# EAGLE design connect4 (EAGLE 9.6.1)
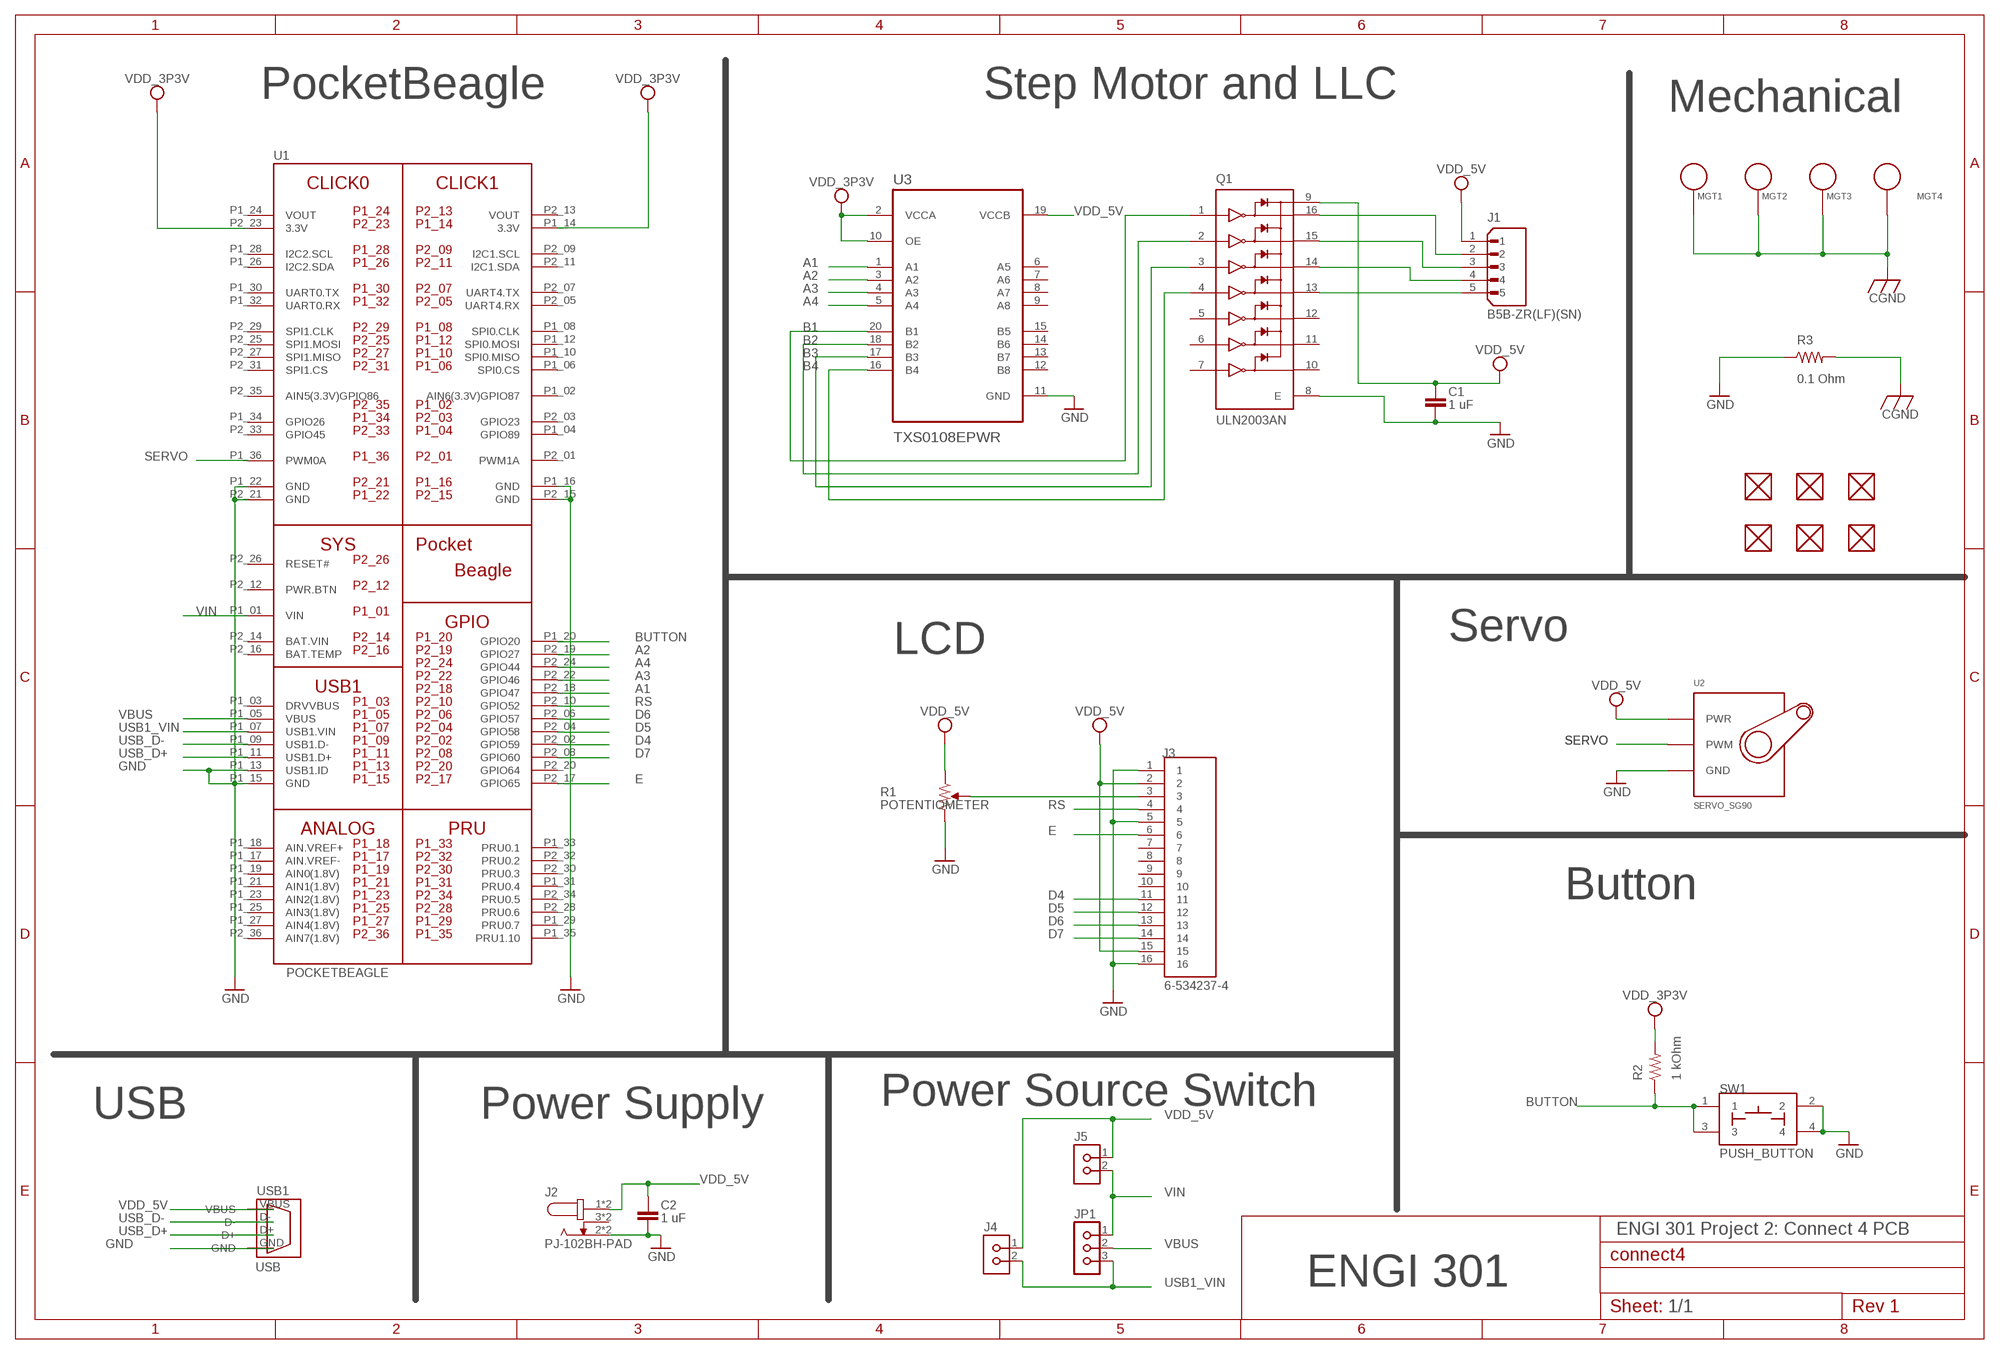
[diagram p0: schematic, sheet 1]

## Parts
C1  1 uF  C_C0402  [C0402]
C2  1 uF  C_C0402  [C0402]
FUD1  FIDUCIAL  [FIDUCIAL_40MIL]
FUD2  FIDUCIAL  [FIDUCIAL_40MIL]
FUD3  FIDUCIAL  [FIDUCIAL_40MIL]
FUD4  FIDUCIAL  [FIDUCIAL_40MIL]
FUD5  FIDUCIAL  [FIDUCIAL_40MIL]
FUD6  FIDUCIAL  [FIDUCIAL_40MIL]
J1  B5B-ZR(LF)(SN)  [JST_B5B-ZR(LF)(SN)]
J2  PJ-102BH-PAD  [CUI_PJ-102BH-DIM-SMT-PAD]
J3  6-534237-4  [TE_6-534237-4]
J4  PINHD-1X2  [H1X2-2.54]
J5  PINHD-1X2  [H1X2-2.54]
JP1  PINHD-1X3  [H1X3-2.54]
MGT1  MOUNTING_HOLE  [MOUNTING_HOLE]
MGT2  MOUNTING_HOLE  [MOUNTING_HOLE]
MGT3  MOUNTING_HOLE  [MOUNTING_HOLE]
MGT4  MOUNTING_HOLE  [MOUNTING_HOLE]
Q1  ULN2003AN  [DIP794W45P254L1969H508Q16]
R1  POTENTIOMETER  [POT-PO90S]
R2  1 kOhm  R_R0603  [R0603]
R3  0.1 Ohm  R_R0805  [R0805]
SW1  PUSH_BUTTON  [BUTTON_12.5MM]
U1  POCKETBEAGLE  [POCKETBEAGLE]
U2  SERVO_SG90  [SERVO-X1]
U3  TXS0108EPWR  [SOP65P640X120-20N]
USB1  USB  [USB]

## Nets
A1: U1.P2_18(GPIO47) U3.1(A1)
A2: U1.P2_19(GPIO27) U3.3(A2)
A3: U1.P2_22(GPIO46) U3.4(A3)
A4: U1.P2_24(GPIO44) U3.5(A4)
B1: Q1.1(1B) U3.20(B1)
B2: Q1.2(2B) U3.18(B2)
B3: Q1.3(3B) U3.17(B3)
B4: Q1.4(4B) U3.16(B4)
BUTTON: R2.1 SW1.1 SW1.3 U1.P1_20(GPIO20)
CGND: MGT1.P$1 MGT2.P$1 MGT3.P$1 MGT4.P$1 R3.2
D4: J3.11 U1.P2_02(GPIO59)
D5: J3.12 U1.P2_04(GPIO58)
D6: J3.13 U1.P2_06(GPIO57)
D7: J3.14 U1.P2_08(GPIO60)
E: J3.6 U1.P2_17(GPIO65)
GND: C1.2 C2.2 J2.2 J2.2_B J3.1 J3.5 J3.16 Q1.8(E) R1.CW R3.1 SW1.2 SW1.4 U1.P1_13(USB1.ID) U1.P1_15(GND) U1.P1_16(GND) U1.P1_22(GND) U1.P2_15(GND) U1.P2_21(GND) U2.GND U3.11(GND) USB1.GND
N$1: J1.2 Q1.16(1C)
N$2: J1.3 Q1.15(2C)
N$3: J3.3 R1.S
N$4: J1.4 Q1.14(3C)
N$5: J1.5 Q1.13(4C)
RS: J3.4 U1.P2_10(GPIO52)
SERVO: U1.P1_36(PWM0A) U2.SIG(PWM)
USB1_VIN: J4.2 JP1.3 U1.P1_07(USB1.VIN)
USB_D+: U1.P1_11(USB1.D+) USB1.D+
USB_D-: U1.P1_09(USB1.D-) USB1.D-
VBUS: JP1.2 U1.P1_05(VBUS)
VDD_3P3V: R2.2 U1.P1_14(3.3V) U1.P2_23(3.3V) U3.2(VCCA) U3.10(OE)
VDD_5V: C1.1 C2.1 J1.1 J2.1 J2.1_B J3.2 J3.15 J4.1 J5.1 Q1.9(COM) R1.CCW U2.PWR U3.19(VCCB) USB1.VBUS
VIN: J5.2 JP1.1 U1.P1_01(VIN)
Unconnected: FUD1.P$1 FUD2.P$1 FUD3.P$1 FUD4.P$1 FUD5.P$1 FUD6.P$1 J2.3 J2.3_B J3.7 J3.8 J3.9 J3.10 Q1.5(5B) Q1.6(6B) Q1.7(7B) Q1.10(7C) Q1.11(6C) Q1.12(5C) U1.P1_02(AIN6(3.3V)GPIO87) U1.P1_03(DRVVBUS) U1.P1_04(GPIO89) U1.P1_06(SPI0.CS) U1.P1_08(SPI0.CLK) U1.P1_10(SPI0.MISO) U1.P1_12(SPI0.MOSI) U1.P1_17(AIN.VREF-) U1.P1_18(AIN.VREF+) U1.P1_19(AIN0(1.8V)) U1.P1_21(AIN1(1.8V)) U1.P1_23(AIN2(1.8V)) U1.P1_25(AIN3(1.8V)) U1.P1_26(I2C2.SDA) U1.P1_27(AIN4(1.8V)) U1.P1_28(I2C2.SCL) U1.P1_29(PRU0.7) U1.P1_30(UART0.TX) U1.P1_31(PRU0.4) U1.P1_32(UART0.RX) U1.P1_33(PRU0.1) U1.P1_34(GPIO26) U1.P1_35(PRU1.10) U1.P2_01(PWM1A) U1.P2_03(GPIO23) U1.P2_05(UART4.RX) U1.P2_07(UART4.TX) U1.P2_09(I2C1.SCL) U1.P2_11(I2C1.SDA) U1.P2_12(PWR.BTN) U1.P2_16(BAT.TEMP) U1.P2_20(GPIO64) U1.P2_25(SPI1.MOSI) U1.P2_26(RESET#) U1.P2_27(SPI1.MISO) U1.P2_28(PRU0.6) U1.P2_29(SPI1.CLK) U1.P2_30(PRU0.3) U1.P2_31(SPI1.CS) U1.P2_32(PRU0.2) U1.P2_33(GPIO45) U1.P2_34(PRU0.5) U1.P2_35(AIN5(3.3V)GPIO86) U1.P2_36(AIN7(1.8V)) U3.6(A5) U3.7(A6) U3.8(A7) U3.9(A8) U3.12(B8) U3.13(B7) U3.14(B6) U3.15(B5)

## Notes on the sheet
- PocketBeagle | Step Motor and LLC | Mechanical
- LCD | Servo
- Button
- USB | Power Supply | Power Source Switch
- ENGI 301 Project 2: Connect 4 PCB
- ENGI 301
- 1/1

## Power pins joined to a net without a drawn wire
BAT.VIN: U1.P2_14(BAT.VIN)
VOUT: U1.P1_24(VOUT) U1.P2_13(VOUT)

## Library data of the parts
C1 C2 = MISC:C_: Capacitor SMD. Sizes: 0402, 0603 & 0805
FUD1-FUD6 = connect4:FIDUCIAL
J1 = connect4:B5B-ZR(LF)(SN): Check availability <https://pricing.snapeda.com/parts/B5B-ZR%20%28LF%29%28SN%29/JST/view-part?ref=eda>; AVAILABILITY: In Stock; DESCRIPTION: Conn Shrouded Header HDR 5 POS 1.5mm Solder ST Thru-Hole Box; MF: JST; MP: B5B-ZR (LF)(SN); PACKAGE: None; PRICE: None; PURCHASE-URL: https://pricing.snapeda.com/search/part/B5B-ZR (LF)(SN)/?ref=eda
J2 = connect4:PJ-102BH: 2.5 mm Center Pin, 5.0 A, Right Angle, Through Hole, Tapered Pins, Dc Power Jack Connector; MANUFACTURER: CUI INC; PART_REV: 1.02; STANDARD: Manufacturer recommendations
J3 = connect4:6-534237-4: Check availability <https://pricing.snapeda.com/parts/6-534237-4/TE%20Connectivity/view-part?ref=eda>; AVAILABILITY: In Stock; COMMENT: 6-534237-4; DESCRIPTION: 16 MODII VRT SR CE 100/115; EU_ROHS_COMPLIANCE: Compliant; MF: TE Connectivity; MP: 6-534237-4; PACKAGE: None; PRICE: None; PURCHASE-URL: https://pricing.snapeda.com/search/part/6-534237-4/?ref=eda
J4 J5 = connect4:PINHD-1X2: 2-pin 100 mil header
JP1 = connect4:PINHD-1X3: PIN HEADER
MGT1-MGT4 = connect4:MOUNTING_HOLE: Chassis Mounting Hole w/GND connection ability
Q1 = connect4:ULN2003AN: Check availability <https://pricing.snapeda.com/parts/ULN2003AN/Texas%20Instruments/view-part?ref=eda>; AVAILABILITY: In Stock; DESCRIPTION: 50-V, 7-ch darlington transistor array, -20C to 70C; MF: Texas Instruments; MP: ULN2003AN; PACKAGE: PDIP-16 Texas Instruments; PRICE: None; PURCHASE-URL: https://pricing.snapeda.com/search/part/ULN2003AN/?ref=eda
R1 = connect4:POTENTIOMETER: Potentiometer - Examples: P090S-14T20BR10K (987-1277-ND)
R2 R3 = connect4:R_: RESISTOR, American symbol
SW1 = connect4:PUSH_BUTTON
U1 = connect4:POCKETBEAGLE
U2 = connect4:SERVO_SG90
U3 = connect4:TXS0108EPWR: Check availability <https://pricing.snapeda.com/parts/TXS0108EPWR/Texas%20Instruments/view-part?ref=eda>; AVAILABILITY: In Stock; DESCRIPTION: 8-bit bidirectional voltage-level shifter for open-drain and push-pull application; MF: Texas Instruments; MP: TXS0108EPWR; PACKAGE: TSSOP-20 Texas Instruments; PRICE: None; PURCHASE-URL: https://pricing.snapeda.com/search/part/TXS0108EPWR/?ref=eda
USB1 = connect4:USB: USB-A1HSW6 USB-A (USB TYPE-A) - Receptacle Connector 4 Position Through Hole, Right Angle

## Board
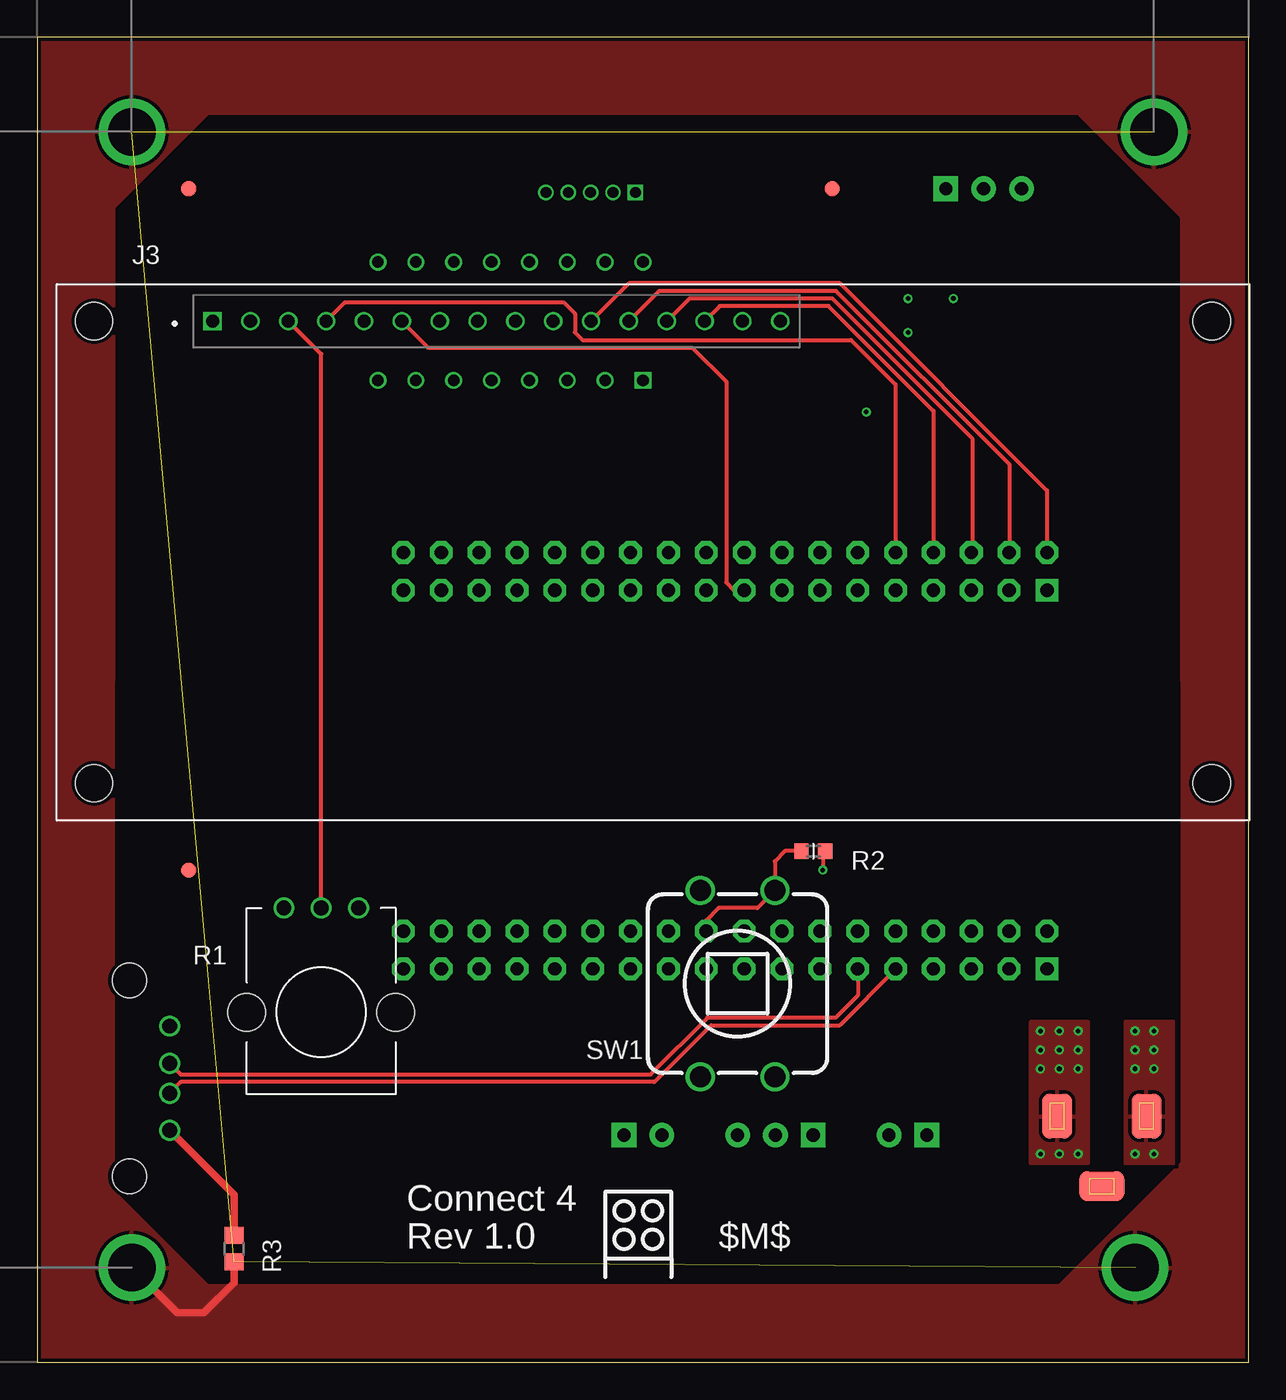
[diagram p1: board, top side]
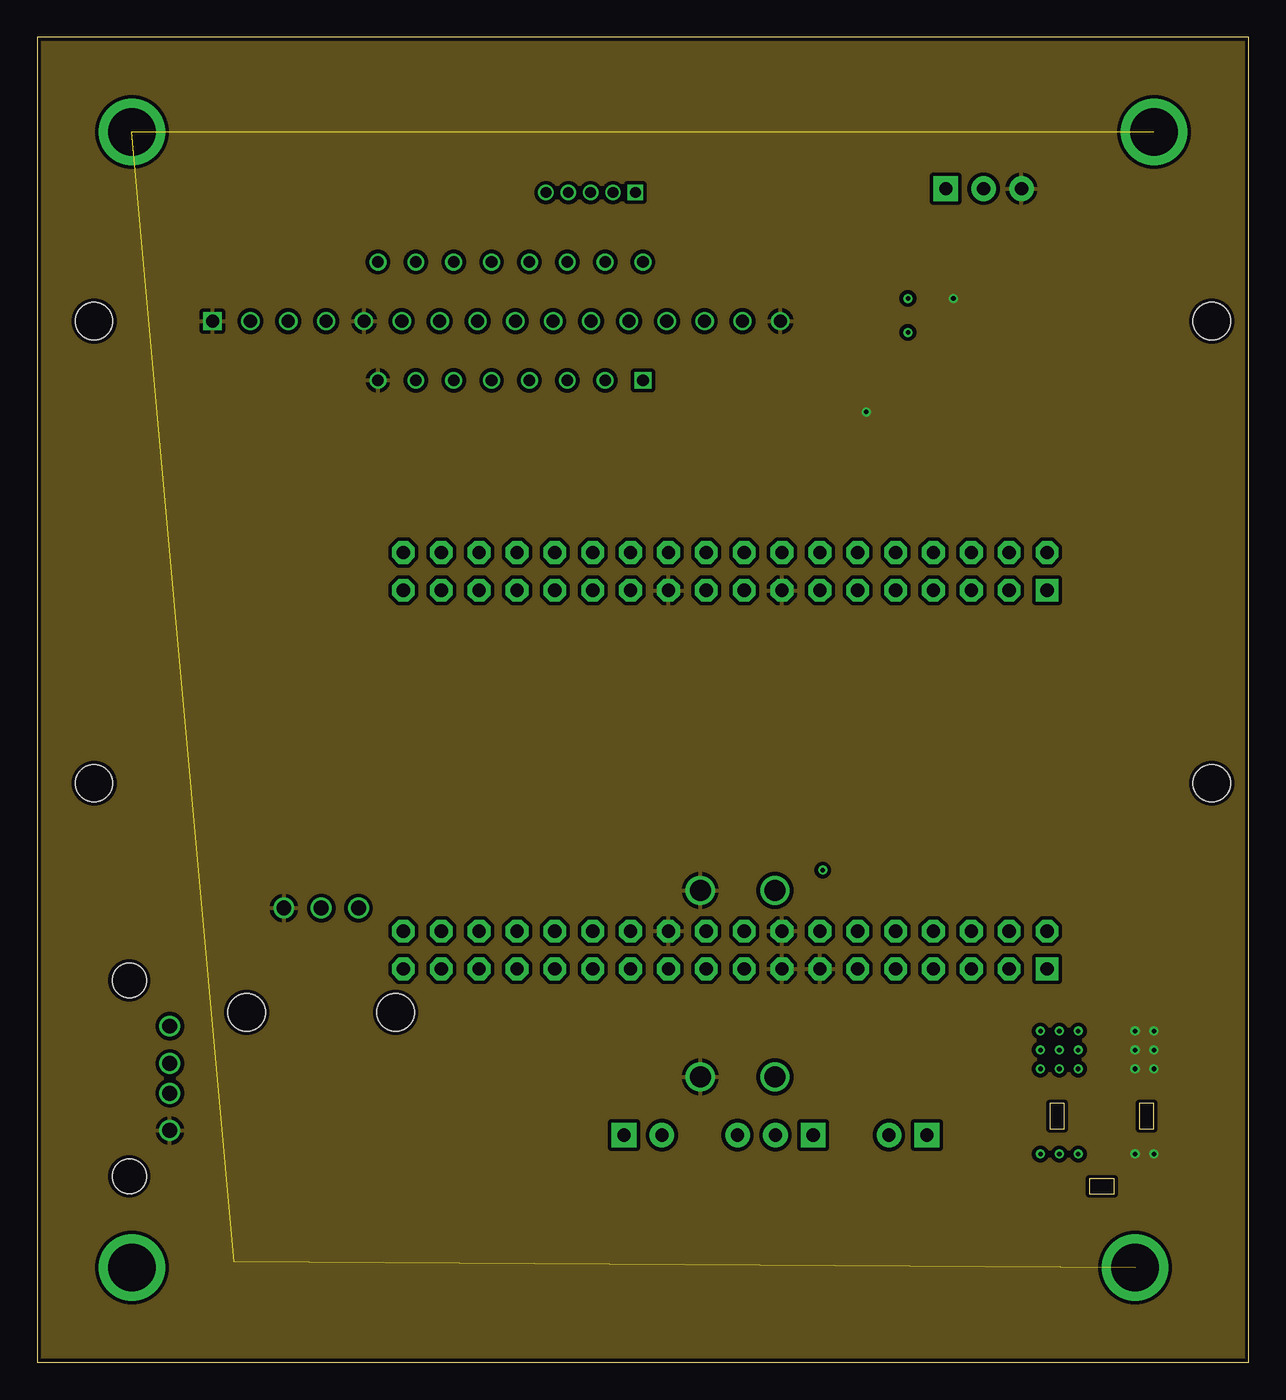
[diagram p2: board, inner layer Route2]
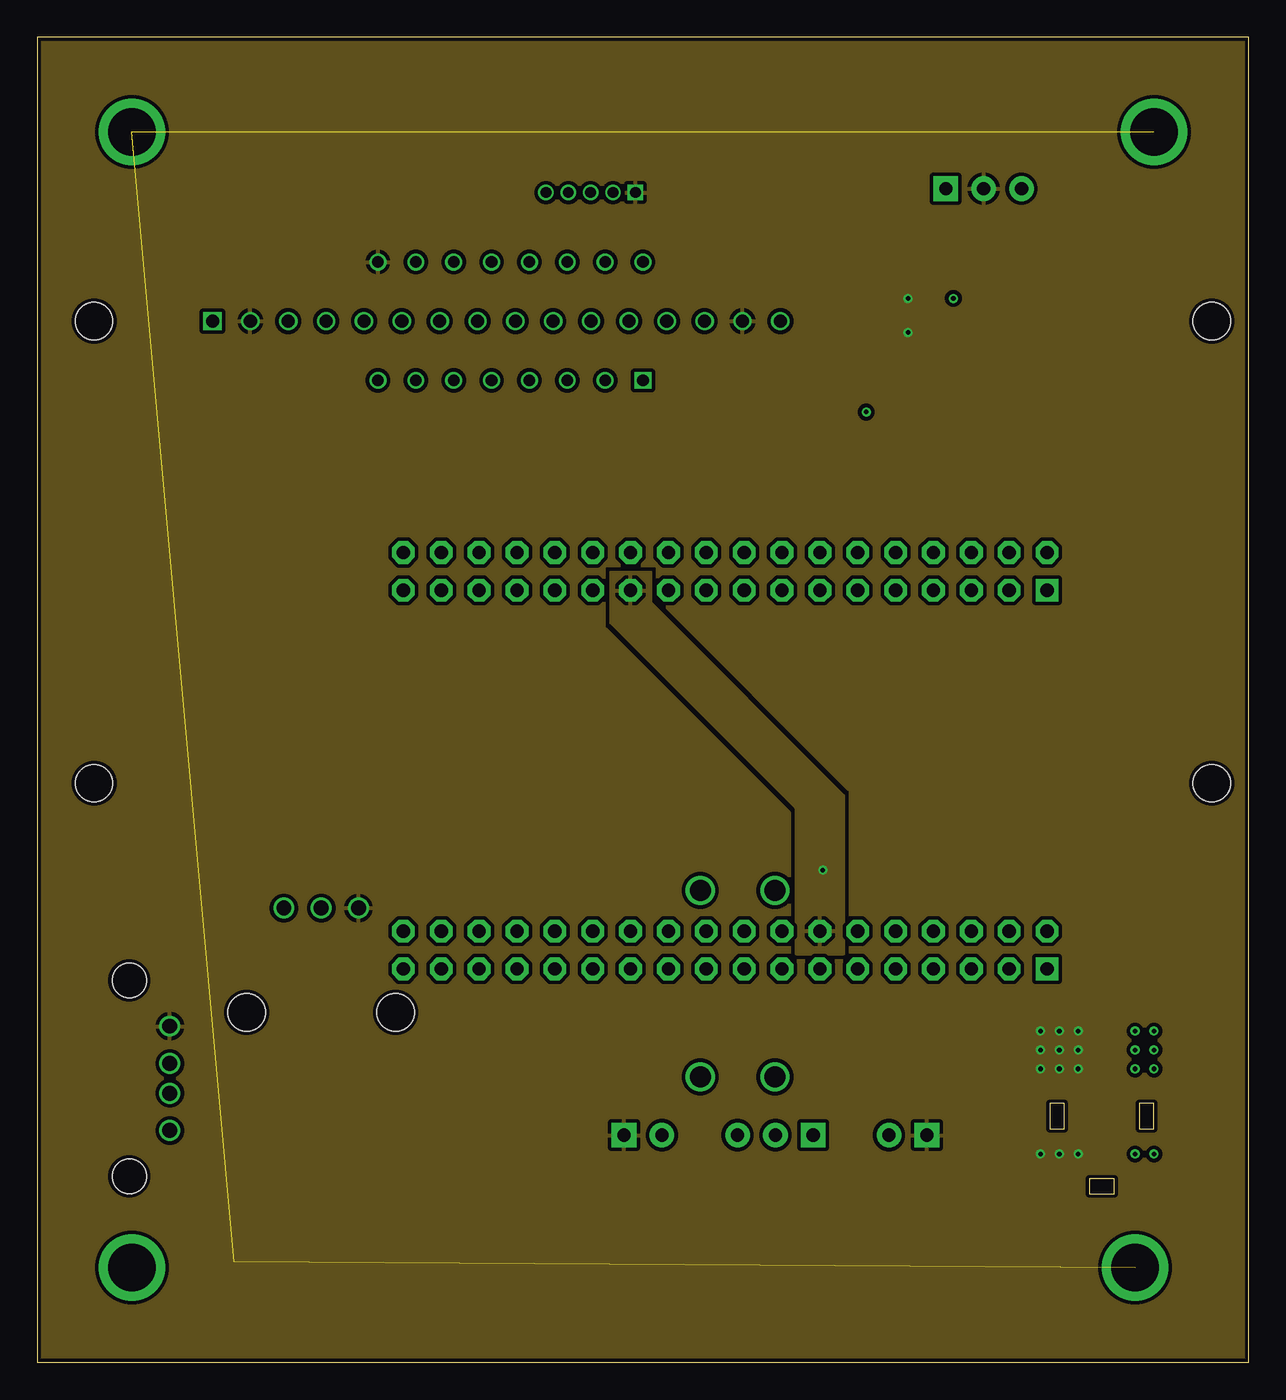
[diagram p3: board, inner layer Route15]
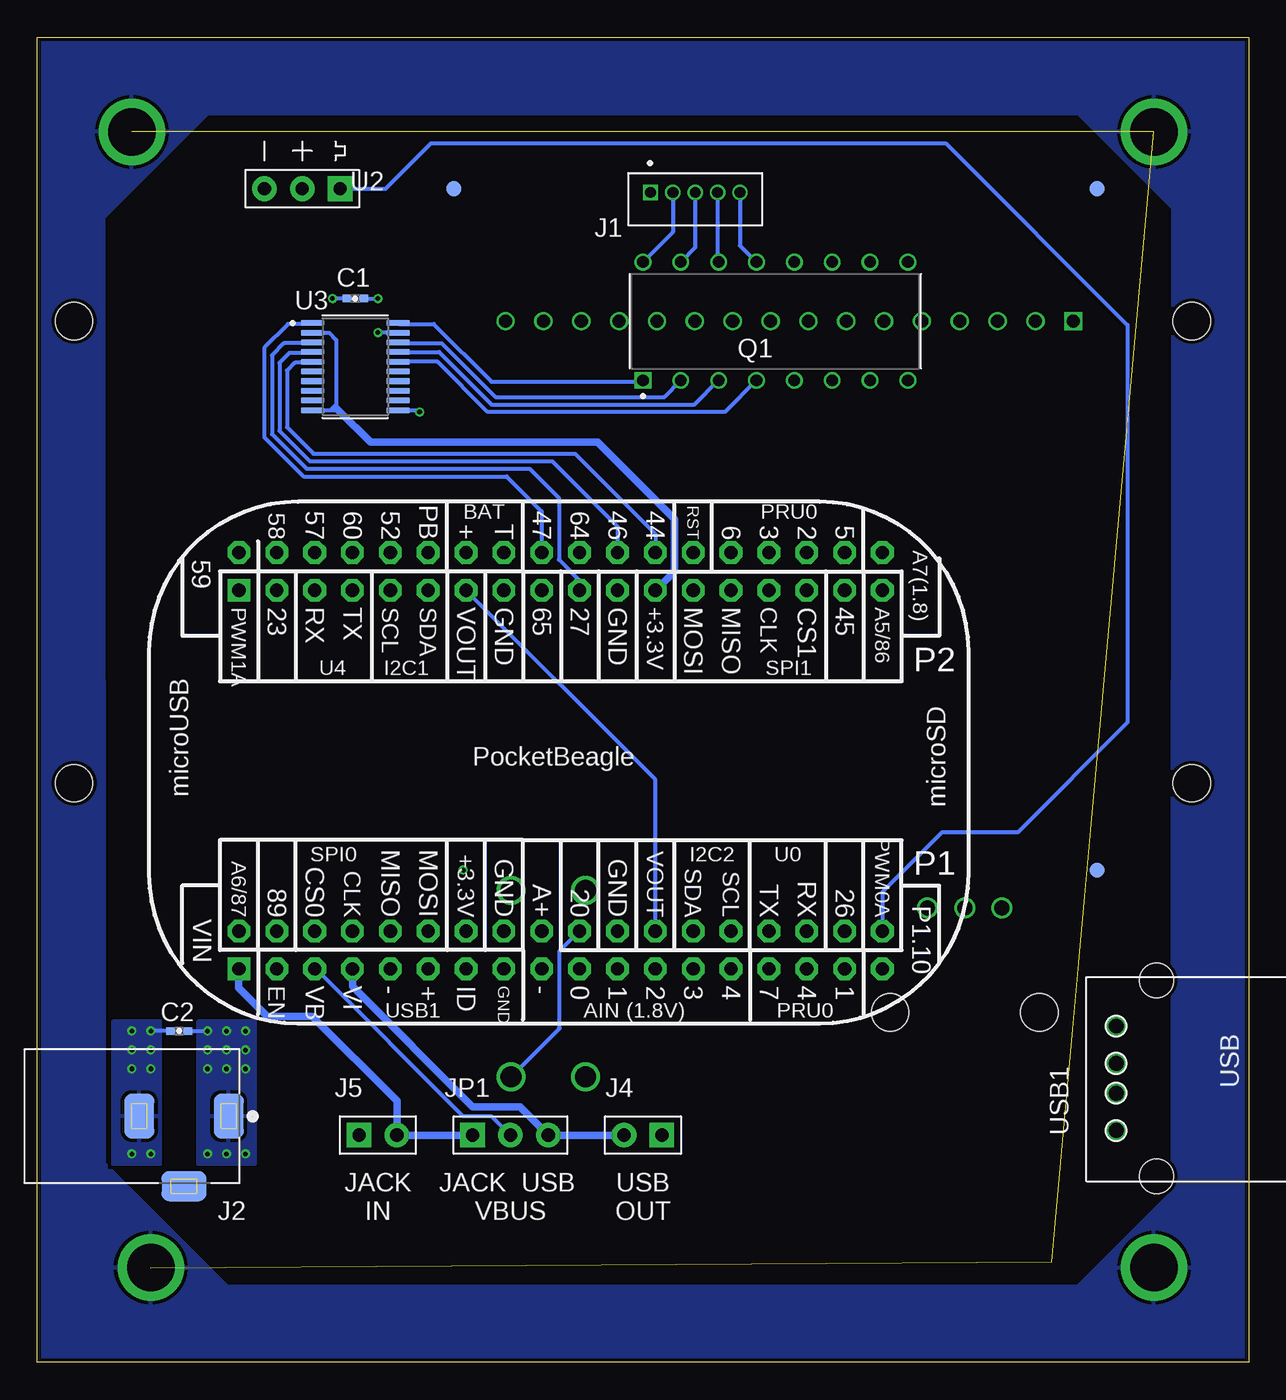
[diagram p4: board, bottom side, seen from below]

Size 81.28 x 88.9 mm. Coordinates in mm from the lower left corner, seen from the top.
Outline: 0,0 81.28,0 81.28,88.9 0,88.9 0,0
Copper layers (1*2*15*16): Top 0.035mm / dielectric 0.23mm / Route2 0.035mm / dielectric 0.93mm / Route15 0.035mm / dielectric 0.23mm / Bottom 0.035mm
Design rules "ENGI301_4lyr": minimum track width 10mil, minimum drill 12mil, track to track 10mil, track to pad 10mil, pad to pad 10mil, via to via 10mil, smd to smd 10mil, copper to edge 10mil, drill to drill 12mil, minimum pad ring 6mil, minimum via ring 6mil, stop-mask expansion 3mil, vias tented up to drill 25mil, thermal gap 10mil

### Footprints (pad centres in the part's own frame; a part is rotated, then mirrored left to right if it is on the bottom)
C0402 = smd 0.61 x 0.508: 1 -0.559,0; 2 0.559,0
FIDUCIAL_40MIL = smd 1.016 x 1.016: P$1 0,0
JST_B5B-ZR(LF)(SN) = drill 0.73 square: 1 0,0 | drill 0.73: 2 -1.5,0; 3 -3,0; 4 -4.5,0; 5 -6,0
CUI_PJ-102BH-DIM-SMT-PAD = smd 2 x 3: 1 -6.5,0; 2 -0.5,0 | smd 2 x 3 bottom: 1_B -6.5,0; 2_B -0.5,0 | smd 3 x 2: 3 -3.5,4.7 | smd 3 x 2 bottom: 3_B -3.5,4.7
TE_6-534237-4 = drill 0.88 square: 1 7.95,0 | drill 0.88: 2 10.49,0; 3 13.03,0; 4 15.57,0; 5 18.11,0; 6 20.65,0; 7 23.19,0; 8 25.73,0; 9 28.27,0; 10 30.81,0; 11 33.35,0; 12 35.89,0; 13 38.43,0; 14 40.97,0; 15 43.51,0; 16 46.05,0 | hole 2.5: 0,0; 75,0; 0,-31; 75,-31
H1X2-2.54 = drill 0.889 pad 1.651 square: 1 0,1.27 | drill 0.889 pad 1.651: 2 0,-1.27
H1X3-2.54 = drill 0.889 pad 1.651 square: 1 0,2.54 | drill 0.889 pad 1.651: 2 0,0; 3 0,-2.54
MOUNTING_HOLE = drill 3.175 pad 4.445: P$1 0,0
DIP794W45P254L1969H508Q16 = drill 0.78 pad 1.13 square: 1 -3.97,8.89 | drill 0.78 pad 1.13: 2 -3.97,6.35; 3 -3.97,3.81; 4 -3.97,1.27; 5 -3.97,-1.27; 6 -3.97,-3.81; 7 -3.97,-6.35; 8 -3.97,-8.89; 9 3.97,-8.89; 10 3.97,-6.35; 11 3.97,-3.81; 12 3.97,-1.27; 13 3.97,1.27; 14 3.97,3.81; 15 3.97,6.35; 16 3.97,8.89
POT-PO90S = drill 1: CCW -2.5,0; CW 2.5,0; S 0,0 | hole 2.5: -5,7; 5,7
R0603 = smd 0.95 x 1.031: 1 -0.8,0; 2 0.8,0
R0805 = smd 1.143 x 1.27: 1 -0.889,0; 2 0.889,0
BUTTON_12.5MM = drill 1.4: 1 -6.25,2.5; 2 -6.25,-2.5; 3 6.25,2.5; 4 6.25,-2.5
POCKETBEAGLE = drill 0.889 pad 1.524 square: P1_01 5.91,3.53; P2_01 5.91,28.93 | drill 0.889 pad 1.524 octagon: P1_02 5.91,6.07; P1_03 8.45,3.53; P1_04 8.45,6.07; P1_05 10.99,3.53; P1_06 10.99,6.07; P1_07 13.53,3.53; P1_08 13.53,6.07; P1_09 16.07,3.53; P1_10 16.07,6.07; P1_11 18.61,3.53; P1_12 18.61,6.07; P1_13 21.15,3.53; P1_14 21.15,6.07; P1_15 23.69,3.53; P1_16 23.69,6.07; P1_17 26.23,3.53; P1_18 26.23,6.07; P1_19 28.77,3.53; P1_20 28.77,6.07; P1_21 31.31,3.53; P1_22 31.31,6.07; P1_23 33.85,3.53; P1_24 33.85,6.07; P1_25 36.39,3.53; P1_26 36.39,6.07; P1_27 38.93,3.53; P1_28 38.93,6.07; P1_29 41.47,3.53; P1_30 41.47,6.07; P1_31 44.01,3.53; P1_32 44.01,6.07; P1_33 46.55,3.53; P1_34 46.55,6.07; P1_35 49.09,3.53; P1_36 49.09,6.07; P2_02 5.91,31.47; P2_03 8.45,28.93; P2_04 8.45,31.47; P2_05 10.99,28.93; P2_06 10.99,31.47; P2_07 13.53,28.93; P2_08 13.53,31.47; P2_09 16.07,28.93; P2_10 16.07,31.47; P2_11 18.61,28.93; P2_12 18.61,31.47; P2_13 21.15,28.93; P2_14 21.15,31.47; P2_15 23.69,28.93; P2_16 23.69,31.47; P2_17 26.23,28.93; P2_18 26.23,31.47; P2_19 28.77,28.93; P2_20 28.77,31.47; P2_21 31.31,28.93; P2_22 31.31,31.47; P2_23 33.85,28.93; P2_24 33.85,31.47; P2_25 36.39,28.93; P2_26 36.39,31.47; P2_27 38.93,28.93; P2_28 38.93,31.47; P2_29 41.47,28.93; P2_30 41.47,31.47; P2_31 44.01,28.93; P2_32 44.01,31.47; P2_33 46.55,28.93; P2_34 46.55,31.47; P2_35 49.09,28.93; P2_36 49.09,31.47
SERVO-X1 = drill 0.889 pad 1.651: GND 0,-2.54; PWR 0,0 | drill 0.889 pad 1.651 square: SIG 0,2.54
SOP65P640X120-20N = smd 1.57 x 0.41: 1 -2.87,2.925; 2 -2.87,2.275; 3 -2.87,1.625; 4 -2.87,0.975; 5 -2.87,0.325; 6 -2.87,-0.325; 7 -2.87,-0.975; 8 -2.87,-1.625; 9 -2.87,-2.275; 10 -2.87,-2.925; 11 2.87,-2.925; 12 2.87,-2.275; 13 2.87,-1.625; 14 2.87,-0.975; 15 2.87,-0.325; 16 2.87,0.325; 17 2.87,0.975; 18 2.87,1.625; 19 2.87,2.275; 20 2.87,2.925
USB = drill 1: D+ 1,0; D- -1,0; GND -3.5,0; VBUS 3.5,0 | hole 2.3: -6.57,-2.71; 6.57,-2.71

### Placement (x,y rotation side)
C1  59.94,71.37 180 bottom
C2  71.75,22.23 180 bottom
FUD1  10.16,78.74 0 bottom
FUD2  10.16,33.02 0 bottom
FUD3  53.34,78.74 0 bottom
FUD4  10.16,78.74 0 top
FUD5  10.16,33.02 0 top
FUD6  53.34,78.74 0 top
J1  40.13,78.49 180 bottom
J2  74.93,16.51 180 bottom
J3  3.81,69.85 0 top
J4  40.64,15.24 270 bottom
J5  58.42,15.24 90 bottom
JP1  49.53,15.24 90 bottom
MGT1  6.35,6.35 0 top
MGT2  73.66,6.35 0 top
MGT3  6.35,82.55 0 top
MGT4  74.93,82.55 0 top
Q1  31.75,69.85 90 bottom
R1  19.05,30.48 180 top
R2  52.07,34.29 0 top
R3  13.21,7.62 270 top
SW1  46.99,25.4 270 top
U1  73.66,22.86 0 bottom
U2  63.5,78.74 270 bottom
U3  59.94,66.8 0 bottom
USB1  8.89,19.05 90 bottom

### Tracks (layer width: path | path; a pad name or v marks a point on that pad's centre or on a via)
A1
  Bottom 0.254: U3.1 62.88,69.66 64.45,69.66 66.04,68.07 66.04,62.06 63.41,59.44 49.78,59.44 47.43,57.08 U1.P2_18
A2
  Bottom 0.254: U3.3 62.88,68.36 64.73,68.36 65.53,67.56 65.53,62.27 63.2,59.94 48.26,59.94 46.29,57.97 46.29,53.86 44.89,52.46 U1.P2_19
A3
  Bottom 0.254: U3.4 62.88,67.71 64.37,67.71 65.02,67.06 65.02,62.48 62.99,60.45 46.74,60.45 42.35,56.07 U1.P2_22
A4
  Bottom 0.254: U3.5 62.88,67.06 64,67.06 64.52,66.55 64.52,62.74 62.74,60.96 45.21,60.96 39.81,55.56 U1.P2_24
B1
  Bottom 0.254: U3.20 57.01,69.66 54.68,69.66 50.8,65.79 40.73,65.79 Q1.1
B2
  Bottom 0.254: U3.18 57.01,68.36 54.14,68.36 50.55,64.77 39.21,64.77 Q1.2
B3
  Bottom 0.254: U3.17 54.31,67.78 50.8,64.26 37.18,64.26 Q1.3
B4
  Bottom 0.254: Q1.4 35.15,63.75 51.05,63.75 54.43,67.13 U3.16
BUTTON
  Top 0.254: U1.P1_20 44.89,29.65 45.72,30.48 48.32,30.48 SW1.1 49.49,33.62 50.16,34.29 R2.1
  Bottom 0.254: SW1.3 46.23,22.41 46.23,27.59 U1.P1_20
CGND  (3 unrouted)
  Top 0.508: R3.2 13.21,5.33 11.18,3.3 9.4,3.3 MGT1.P$1
  pour Top: -2.54,91.44 83.82,91.44 83.82,45.72 76.83,45.72 76.83,76.83 69.85,83.82 11.43,83.82 5.08,77.47 5.08,45.72 -2.54,45.72
  pour Top (rank 6): -2.54,45.72 -2.54,-2.54 83.82,-2.54 83.82,45.72 76.83,45.72 76.83,13.34 68.58,5.08 11.43,5.08 5.08,11.43 5.08,45.72
  pour Bottom: -2.54,91.44 83.82,91.44 83.82,45.72 76.83,45.72 76.83,76.83 69.85,83.82 11.43,83.82 5.08,77.47 5.08,45.72 -2.54,45.72
  pour Bottom (rank 6): -2.54,45.72 -2.54,-2.54 83.82,-2.54 83.82,45.72 76.83,45.72 76.83,13.34 68.58,5.08 11.43,5.08 5.08,11.43 5.08,45.72
D4
  Top 0.254: U1.P2_02 67.75,58.49 53.85,72.39 39.7,72.39 J3.11
D5
  Top 0.254: U1.P2_04 65.21,60.27 53.59,71.88 41.73,71.88 J3.12
D6
  Top 0.254: U1.P2_06 62.74,54.4 62.74,61.98 53.34,71.37 43.76,71.37 J3.13
D7
  Top 0.254: J3.14 45.8,70.87 53.09,70.87 60.13,63.82 U1.P2_08
E
  Top 0.254: J3.6 26.24,68.07 43.94,68.07 46.23,65.79 46.23,52.32 46.76,51.79 U1.P2_17
GND  (via drill 0.3 pad 0.61)
  Top 0.508: USB1.GND 13.21,11.23 R3.1
  Bottom 0.254: C2.2 v73.66,22.23 | U3.11 55.75,63.88 v55.63,63.75 | C1.2 v61.47,71.37
  other vias: 74.93,22.23 73.66,20.95 74.93,20.95 73.66,19.68 74.93,19.68 73.66,13.97 74.93,13.97
  pour Route2: -2.54,91.44 83.82,91.44 83.82,-2.54 -2.54,-2.54
  pour Top: 73.03,13.34 73.03,22.86 76.2,22.86 76.2,13.34
  pour Bottom: 73.03,13.34 73.03,22.86 76.2,22.86 76.2,13.34
N$1
  Bottom 0.254: J1.2 38.63,75.83 Q1.16
N$2
  Bottom 0.254: J1.3 37.13,74.79 Q1.15
N$3
  Top 0.254: R1.S 19.05,67.64 J3.3
N$4
  Bottom 0.254: Q1.14 35.63,73.89 J1.4
N$5
  Bottom 0.254: Q1.13 34.13,74.93 J1.5
RS
  Top 0.254: U1.P2_10 57.59,65.6 54.61,68.58 36.58,68.58 36.07,69.09 36.07,70.36 35.31,71.12 20.65,71.12 J3.4
SERVO
  Bottom 0.254: U2.SIG 57.91,78.74 54.86,81.79 20.32,81.79 8.13,69.6 8.13,42.93 15.49,35.56 20.57,35.56 24.57,31.56 U1.P1_36
USB1_VIN
  Bottom 0.508: J4.2 JP1.3 48.9,17.14 52.07,17.14 60.13,25.2 U1.P1_07
USB_D+
  Top 0.254: U1.P1_11 55.05,24.61 53.55,23.11 44.96,23.11 41.15,19.3 9.64,19.3 USB1.D+
USB_D-
  Top 0.254: USB1.D- 9.64,18.8 41.4,18.8 45.21,22.61 53.85,22.61 57.59,26.35 U1.P1_09
VBUS
  Bottom 0.254: JP1.2 50.8,16.51 52.7,16.51 62.59,26.39 U1.P1_05
VDD_3P3V  (via drill 0.3)
  Top 0.254: R2.2 52.7,34.12 v52.7,33.02
  Bottom 0.254: U3.2 61.71,69.08 61.21,68.58 61.21,64.26 | 61.21,64.26 61.21,64.01 | 61.21,64.26 61.59,63.88 | U3.10 61.08,63.88 61.02,63.82
  Bottom 0.508: U1.P2_23 38.54,53.06 38.54,56.57 43.69,61.72 58.93,61.72 61.02,63.82 61.21,64.01
  pour Route15: 50.93,27.43 54.1,27.43 54.1,37.97 41.15,50.93 41.15,52.96 38.48,52.96 38.48,49.66 50.93,37.21
VDD_5V  (via drill 0.3 pad 0.61)
  Bottom 0.254: C2.1 v69.85,22.23 | C1.1 v58.42,71.37 | U3.19 57.09,69.09 v58.42,69.09
  other vias: 67.31,20.95 67.31,22.23 67.31,19.68 68.58,20.95 68.58,22.23 69.85,20.95 69.85,19.68 68.58,19.68 67.31,13.97 68.58,13.97 69.85,13.97
  pour Route15 (rank 6): -2.54,91.44 83.82,91.44 83.82,-2.54 -2.54,-2.54
  pour Top: 66.67,13.34 66.67,22.86 70.48,22.86 70.48,13.34
  pour Bottom: 66.67,13.34 66.67,22.86 70.48,22.86 70.48,13.34
VIN
  Bottom 0.508: JP1.1 J5.2 57.15,17.53 62.84,23.21 65.84,23.21 67.75,25.12 U1.P1_01
VOUT
  Bottom 0.254: U1.P1_24 39.81,39.09 U1.P2_13

### Text on the board
tPlace: Connect 4 | Rev 1.0 | $M$
bPlace: USB / OUT | USB | JACK | JACK / IN | VBUS